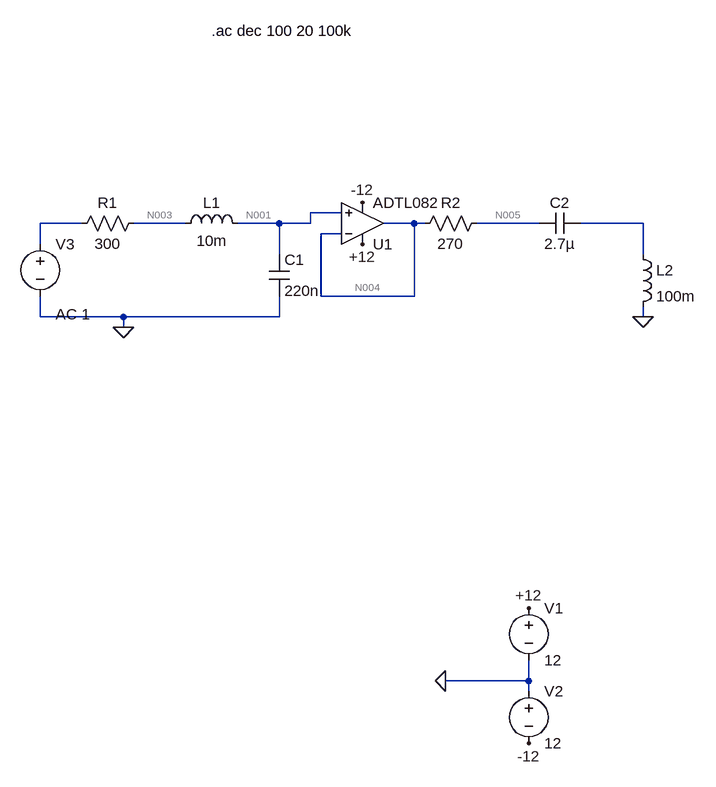
[diagram p0: schematic filtrorlc.asc]
filtrorlc.asc, the LTspice schematic file:
Version 4.1
SHEET 1 1420 708
WIRE 576 -192 528 -192
WIRE 176 -176 112 -176
WIRE 336 -176 256 -176
WIRE 480 -176 416 -176
WIRE 528 -176 528 -192
WIRE 528 -176 480 -176
WIRE 688 -176 640 -176
WIRE 704 -176 688 -176
WIRE 880 -176 784 -176
WIRE 1040 -176 944 -176
WIRE 576 -160 544 -160
WIRE 112 -144 112 -176
WIRE 480 -128 480 -176
WIRE 1040 -128 1040 -176
WIRE 544 -64 544 -160
WIRE 688 -64 688 -176
WIRE 688 -64 544 -64
WIRE 112 -32 112 -64
WIRE 240 -32 112 -32
WIRE 480 -32 480 -64
WIRE 480 -32 240 -32
WIRE 1040 -32 1040 -48
WIRE 240 -16 240 -32
WIRE 864 528 864 496
WIRE 864 528 736 528
WIRE 864 544 864 528
FLAG 736 528 0
FLAG 864 416 +12
FLAG 864 624 -12
FLAG 608 -208 -12
FLAG 608 -144 +12
FLAG 240 -16 0
FLAG 1040 -32 0
SYMBOL OpAmps\\ADTL082 608 -112 M180
SYMATTR InstName U1
SYMBOL voltage 864 400 R0
WINDOW 123 0 0 Left 0
WINDOW 39 0 0 Left 0
SYMATTR InstName V1
SYMATTR Value 12
SYMBOL voltage 864 528 R0
WINDOW 123 0 0 Left 0
WINDOW 39 0 0 Left 0
SYMATTR InstName V2
SYMATTR Value 12
SYMBOL voltage 112 -160 R0
WINDOW 123 24 124 Left 2
WINDOW 39 0 0 Left 0
SYMATTR Value2 AC 1
SYMATTR InstName V3
SYMATTR Value ""
SYMBOL res 272 -192 R90
WINDOW 0 0 56 VBottom 2
WINDOW 3 32 56 VTop 2
SYMATTR InstName R1
SYMATTR Value 300
SYMBOL ind 320 -160 R270
WINDOW 0 32 56 VTop 2
WINDOW 3 5 56 VBottom 2
SYMATTR InstName L1
SYMATTR Value 10m
SYMATTR SpiceLine Rser=1m
SYMBOL cap 464 -128 R0
SYMATTR InstName C1
SYMATTR Value 220n
SYMBOL res 800 -192 R90
WINDOW 0 0 56 VBottom 2
WINDOW 3 32 56 VTop 2
SYMATTR InstName R2
SYMATTR Value 270
SYMBOL cap 944 -192 R90
WINDOW 0 0 32 VBottom 2
WINDOW 3 32 32 VTop 2
SYMATTR InstName C2
SYMATTR Value 2.7µ
SYMBOL ind 1024 -144 R0
SYMATTR InstName L2
SYMATTR Value 100m
SYMATTR SpiceLine Rser=1m
TEXT 376 -472 Left 2 !.ac dec 100 20 100k

The netlist it stands for:
* filtrorlc.asc
X§U1 N001 N004 +12 -12 N004 ADTL082  ; pins In+ In- V+ V- OUT
V1 +12 0 12
V2 0 -12 12
V3 N002 0 AC 1
R1 N003 N002 300
L1 N003 N001 10m Rser=1m
C1 N001 0 220n
R2 N005 N004 270
C2 N006 N005 2.7µ
L2 N006 0 100m Rser=1m
.ac dec 100 20 100k
.lib ADI.lib
.backanno
.end

* Results of the author's LTspice run, read from the files saved beside the schematic
* Operating Point, zero values left out:
*   V(+12) = 12 V
*   V(-12) = -12 V
*   I(L1) = 2 pA
*   I(R1) = -2 pA
*   I(V1) = -5.055 mA
*   I(V2) = -5.055 mA
*   I(V3) = -2 pA
*   Ix(u1:1) = 2 pA
*   Ix(u1:2) = 2 pA
*   Ix(u1:3) = 5.055 mA
*   Ix(u1:4) = -5.055 mA
*   Ix(u1:5) = -2 pA
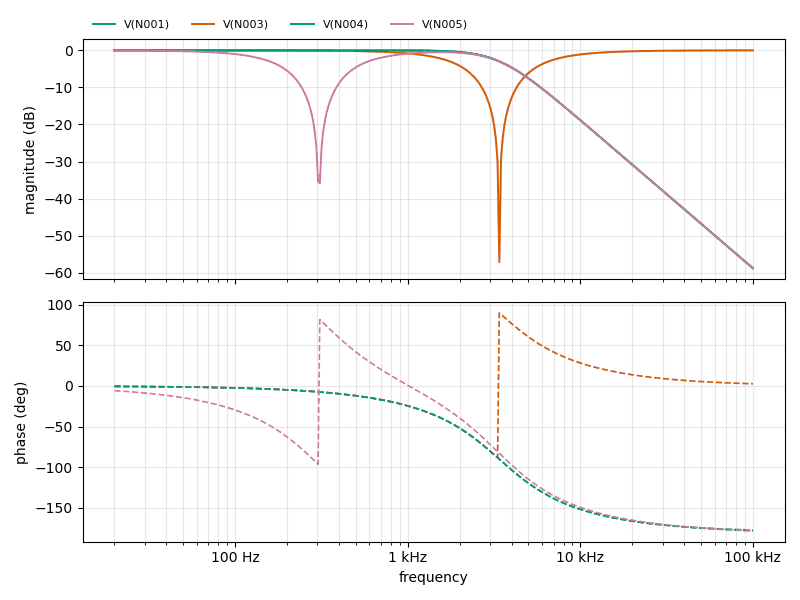
[diagram p1: AC Analysis of filtrorlc.asc, plotted from the saved traces]
* AC Analysis, 1 run:
*   V(N001): 0.00 dB at 20 Hz, -58.78 dB at 100 kHz, peak 0.00 dB at 339.6 Hz, 3 dB below the peak at 3.41 kHz
*   V(N003): -0.00 dB at 20 Hz, -0.01 dB at 100 kHz, peak -0.00 dB at 20 Hz, 3 dB below the peak at 1.761 kHz
*   V(N004): -0.00 dB at 20 Hz, -58.78 dB at 100 kHz, peak 0.00 dB at 276.1 Hz, 3 dB below the peak at 3.41 kHz
*   V(N005): -0.04 dB at 20 Hz, -58.78 dB at 100 kHz, peak -0.04 dB at 20 Hz, 3 dB below the peak at 160 Hz